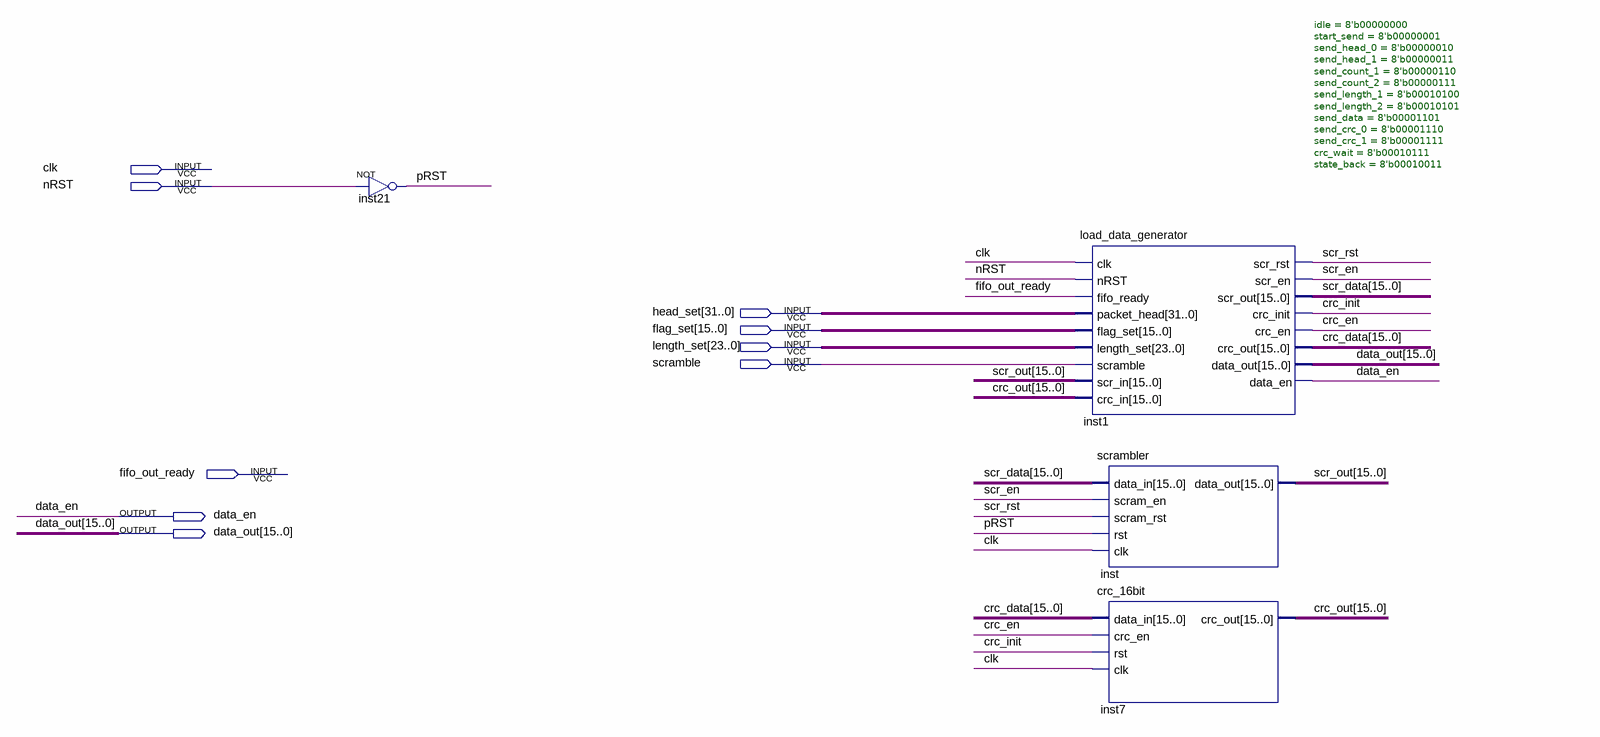
[diagram p0: schematic sheet]
// Quartus schematic inner_source.bdf as structural Verilog: 4 symbols, 9 pins
module inner_source (
  input  clk,
  input  nRST,
  input  [31:0] head_set,
  input  [15:0] flag_set,
  input  [23:0] length_set,
  input  scramble,
  input  fifo_out_ready,
  output data_en,
  output [15:0] data_out
);

  wire crc_en, crc_init, pRST, scr_en, scr_rst;
  wire [15:0] crc_data, crc_out, scr_data, scr_out;

  not inst21 (pRST, nRST);
  load_data_generator #(.idle(8'b00000000), .start_send(8'b00000001), .send_head_0(8'b00000010), .send_head_1(8'b00000011), .send_count_1(8'b00000110), .send_count_2(8'b00000111), .send_length_1(8'b00010100), .send_length_2(8'b00010101), .send_data(8'b00001101), .send_crc_0(8'b00001110), .send_crc_1(8'b00001111), .crc_wait(8'b00010111), .state_back(8'b00010011)) inst1 (
    .clk(clk), .nRST(nRST), .fifo_ready(fifo_out_ready), .packet_head(head_set), .flag_set(flag_set),
    .length_set(length_set), .scramble(scramble), .scr_in(scr_out), .crc_in(crc_out), .scr_rst(scr_rst),
    .scr_en(scr_en), .scr_out(scr_data), .crc_init(crc_init), .crc_en(crc_en), .crc_out(crc_data),
    .data_out(data_out), .data_en(data_en));
  scrambler inst (
    .data_in(scr_data), .scram_en(scr_en), .scram_rst(scr_rst), .rst(pRST), .clk(clk), .data_out(scr_out));
  crc_16bit inst7 (.data_in(crc_data), .crc_en(crc_en), .rst(crc_init), .clk(clk), .crc_out(crc_out));
endmodule
